# EasyEDA Pro project 小张FOC-STM32G431CBU6.epro, schematic Schematic1_4
Board Name: 主驱一体_V1.2（有源晶振）; Create Date: 2024-11-16; Page Name: P1; Project Name: 小张FOC-STM32G431CBU6; Schematic Name: Schematic1_4; Update Date: 2025-01-13; Company: 嘉立创EDA; Page Size: A3; Version: V1.0
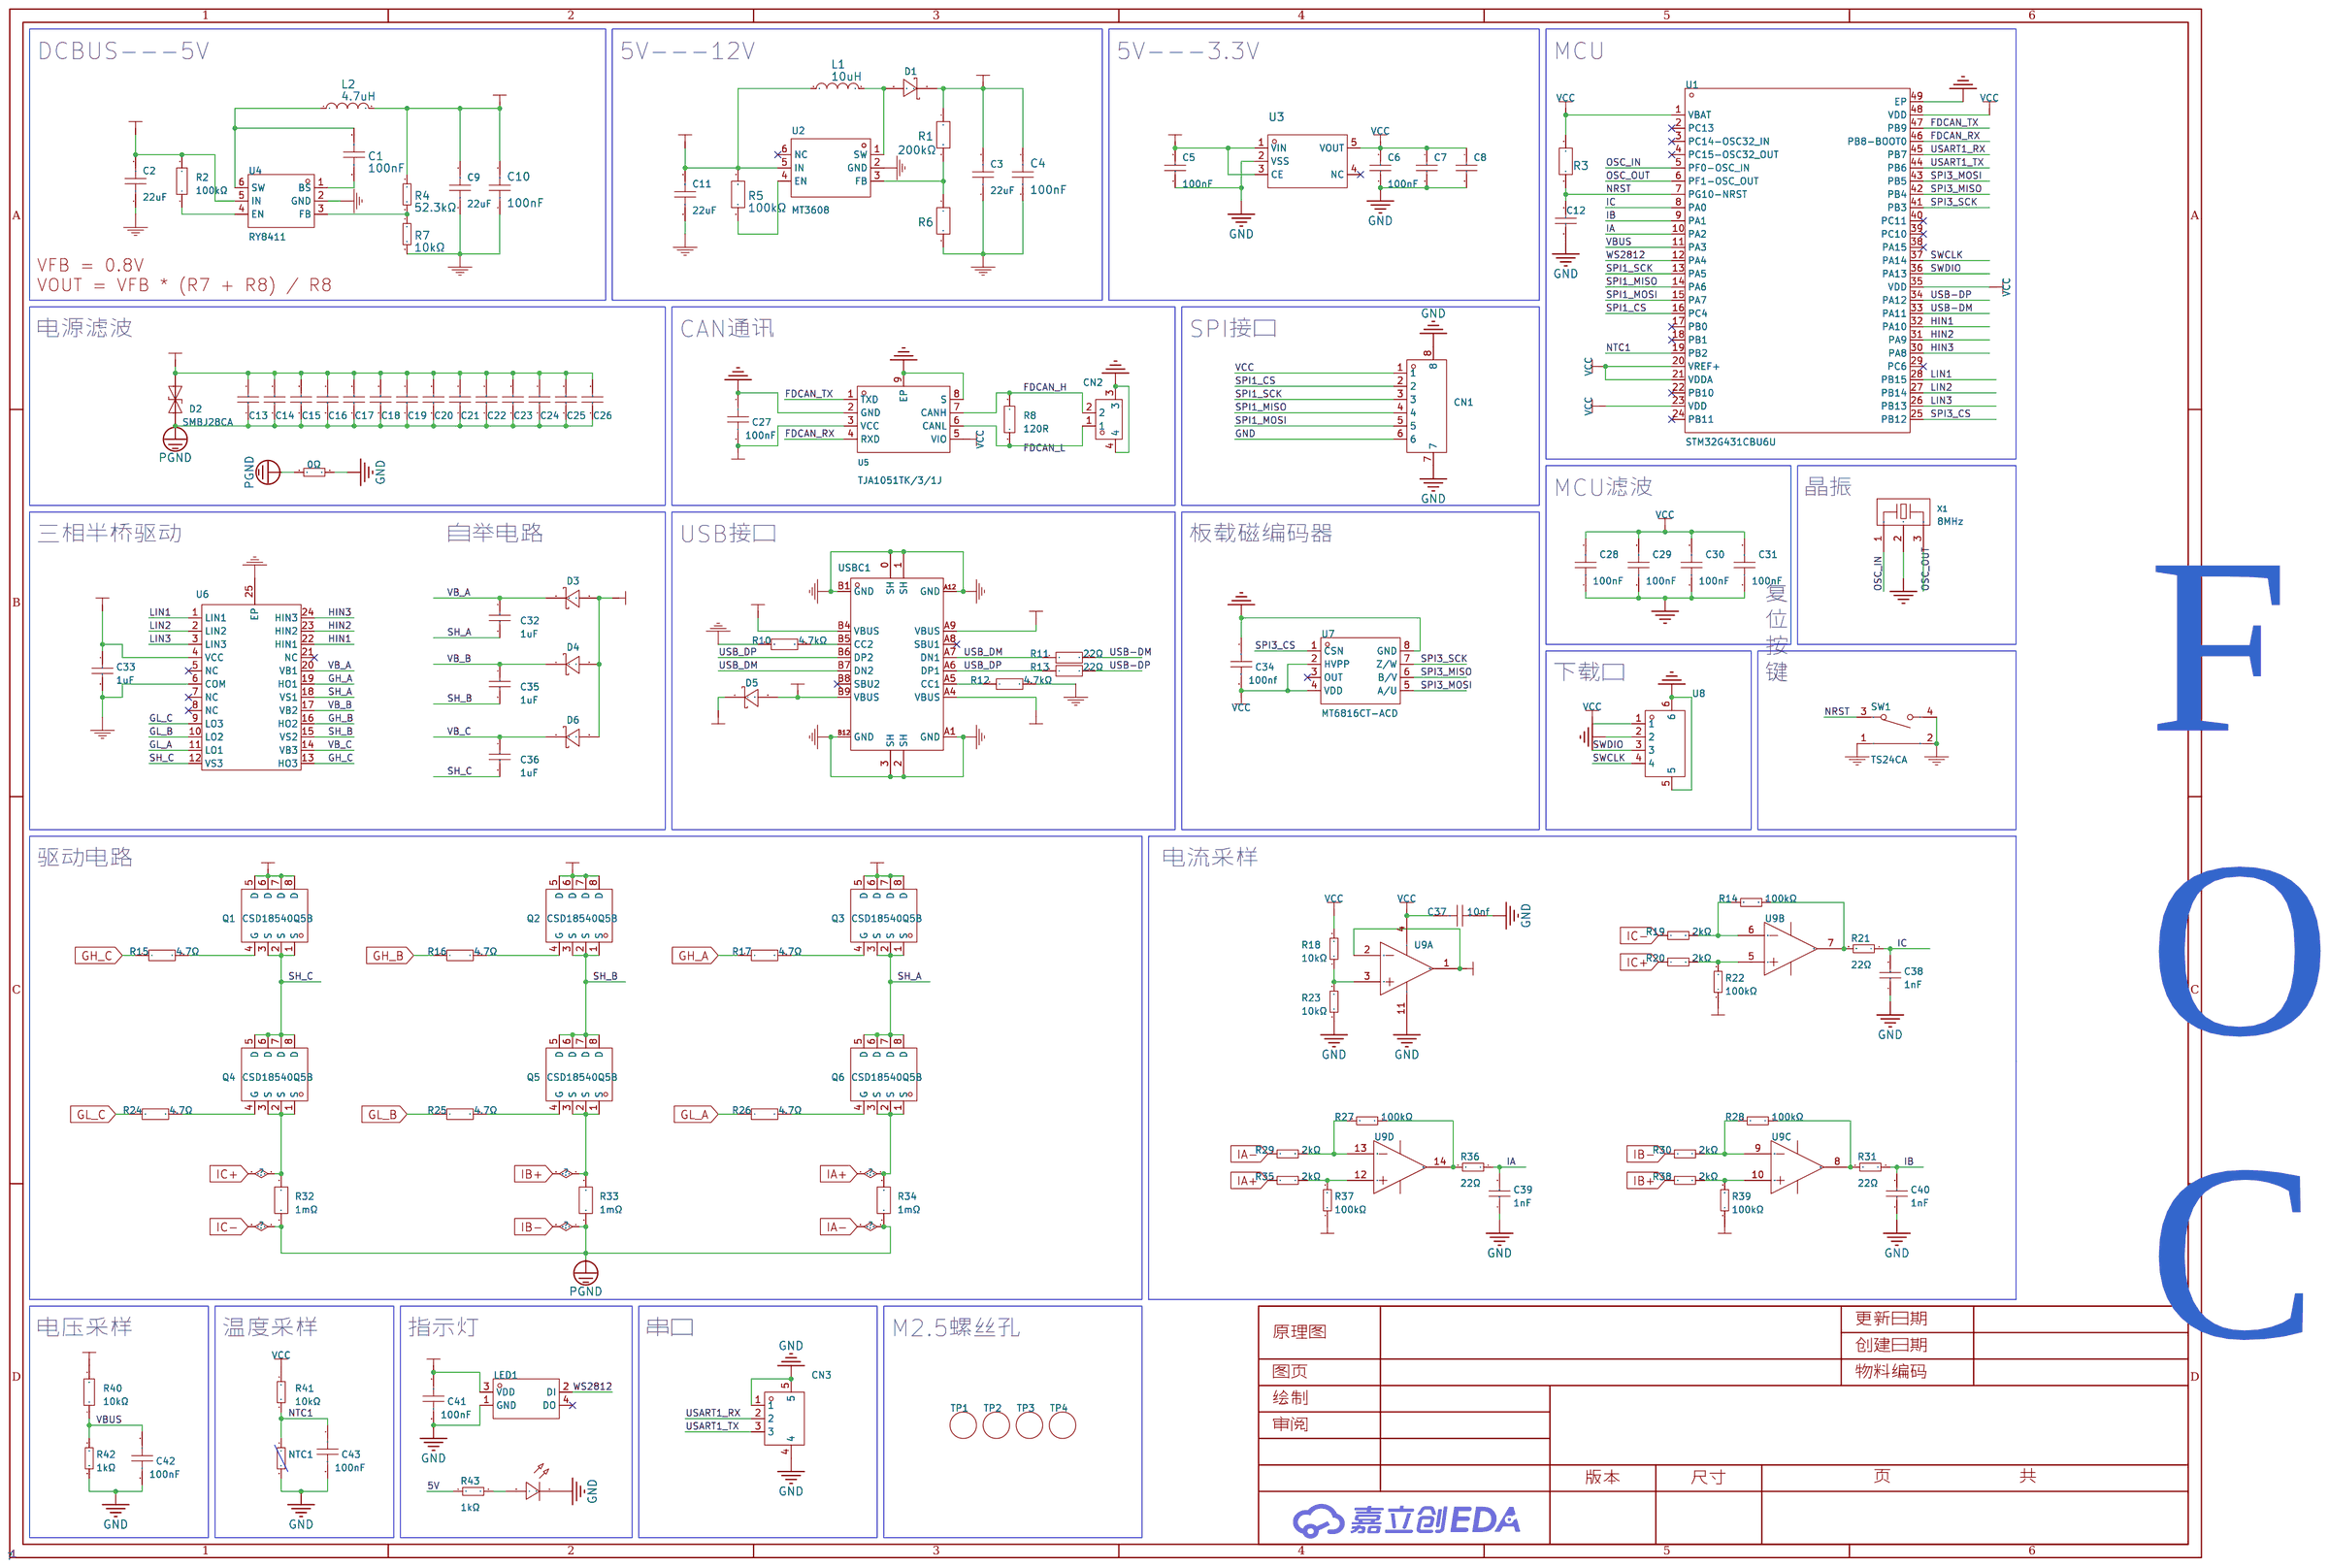
[diagram p6: schematic sheet]

## Parts
C1  100nF  [C0603_S]
C2  22uF  [C0805_SMALL]
C3  22uF  [C0805_SMALL]
C4  100nF  [C0603_SMALL]
C5  100nF  [C0603_SMALL]
C6  100nF  [C0603_SMALL]
C7  100nF  [C0603_SMALL]
C8  100nF  [C0603_SMALL]
C9  22uF  [C0805_SMALL]
C10  100nF  [C0603_S]
C11  22uF  [C0805_SMALL]
C12  100nF  [C0603_SMALL]
C13  10uF  [C1206_SMALL]
C14  10uF  [C1206_SMALL]
C15  10uF  [C1206_SMALL]
C16  10uF  [C1206_SMALL]
C17  10uF  [C1206_SMALL]
C18  10uF  [C1206_SMALL]
C19  10uF  [C1206_SMALL]
C20  10uF  [C1206_SMALL]
C21  10uF  [C1206_SMALL]
C22  10uF  [C1206_SMALL]
C23  10uF  [C1206_SMALL]
C24  10uF  [C1206_SMALL]
C25  10uF  [C1206_SMALL]
C26  10uF  [C1206_SMALL]
C27  100nF  [C0603_SMALL]
C28  100nF  [C0603_SMALL]
C29  100nF  [C0603_SMALL]
C30  100nF  [C0603_SMALL]
C31  100nF  [C0603_SMALL]
C32  1uF  [C0603_SMALL]
C33  1uF  [C0603_SMALL]
C34  100nf  [C0603_SMALL]
C35  1uF  [C0603_SMALL]
C36  1uF  [C0603_SMALL]
C37  10nf  [C0603_SMALL]
C38  1nF  [C0603_S]
C39  1nF  [C0603_S]
C40  1nF  [C0603_S]
C41  100nF  [C0603_SMALL]
C42  100nF  [C0603_SMALL]
C43  100nF  [C0603_SMALL]
CN1  WAFER-GH1.25-6PWB  [CONN-SMD_6P-P1.25_XUNPU_WAFER-GH1.25-6PWB]
CN2  X1251WRS-02HF-LPSW  [CONN-SMD_2P-P1.25_X1251WRS-02HF-LPSW]
CN3  WAFER-GH1.25-3PWB  [CONN-TH_3P-P1.25_GH1.25]
D1  B16WS  [SOD-323_L1.8-W1.3-LS2.5-RD]
D2  SMBJ28CA  [SMB_L4.6-W3.6-LS5.3-BI]
D3  B16WS  [SOD-323_L1.8-W1.3-LS2.5-RD]
D4  B16WS  [SOD-323_L1.8-W1.3-LS2.5-RD]
D5  B16WS  [SOD-323_L1.8-W1.3-LS2.5-RD]
D6  B16WS  [SOD-323_L1.8-W1.3-LS2.5-RD]
L1  10uH  [IND-SMD_L2.5-W2.0]
L2  4.7uH  [IND-SMD_L2.5-W2.0]
LED1  XL-3528RGBW-WS2812B  [LED-SMD_4P-L3.5-W2.8-BR-1]
LED2  -  [LED0603_RED_SMALL]
NTC1  NCP18XH103F03RB  [R0603_SMALL]
Q1  CSD18540Q5B  [VSON-CLIP-8_L5.0-W6.0-P1.27-BL]
Q2  CSD18540Q5B  [VSON-CLIP-8_L5.0-W6.0-P1.27-BL]
Q3  CSD18540Q5B  [VSON-CLIP-8_L5.0-W6.0-P1.27-BL]
Q4  CSD18540Q5B  [VSON-CLIP-8_L5.0-W6.0-P1.27-BL]
Q5  CSD18540Q5B  [VSON-CLIP-8_L5.0-W6.0-P1.27-BL]
Q6  CSD18540Q5B  [VSON-CLIP-8_L5.0-W6.0-P1.27-BL]
R1  200kΩ  [r0603_small]
R2  100kΩ  [R0603_SMALL]
R3  10kΩ  [R0603_SMALL]
R4  52.3kΩ  [R0603_S]
R5  100kΩ  [r0603_small]
R6  10kΩ  [r0603_small]
R7  10kΩ  [R0603_S]
R8  120R  [R0603_SMALL]
R9  0Ω  [R0603_SMALL]
R10  4.7kΩ  [R0603_SMALL]
R11  22Ω  [R0603_SMALL]
R12  4.7kΩ  [R0603_SMALL]
R13  22Ω  [R0603_SMALL]
R14  100kΩ  [R0603_S]
R15  4.7Ω  [R0603_SMALL]
R16  4.7Ω  [R0603_SMALL]
R17  4.7Ω  [R0603_SMALL]
R18  10kΩ  [R0603_S]
R19  2kΩ  [R0603_S]
R20  2kΩ  [R0603_S]
R21  22Ω  [R0603_S]
R22  100kΩ  [R0603_S]
R23  10kΩ  [R0603_S]
R24  4.7Ω  [R0603_SMALL]
R25  4.7Ω  [R0603_SMALL]
R26  4.7Ω  [R0603_SMALL]
R27  100kΩ  [R0603_S]
R28  100kΩ  [R0603_S]
R29  2kΩ  [R0603_S]
R30  2kΩ  [R0603_S]
R31  22Ω  [R0603_S]
R32  1mΩ  [RES-SMD_L6.4-W3.2_LR2512D-3W-1MR]
R33  1mΩ  [RES-SMD_L6.4-W3.2_LR2512D-3W-1MR]
R34  1mΩ  [RES-SMD_L6.4-W3.2_LR2512D-3W-1MR]
R35  2kΩ  [R0603_S]
R36  22Ω  [R0603_S]
R37  100kΩ  [R0603_S]
R38  2kΩ  [R0603_S]
R39  100kΩ  [R0603_S]
R40  10kΩ  [R0603_SMALL]
R41  10kΩ  [R0603_SMALL]
R42  1kΩ  [R0603_SMALL]
R43  1kΩ  [R0603_SMALL]
SW1  TS24CA  [SW-SMD_TS24CA]
TP1  -  [M2.5螺丝孔]
TP2  -  [M2.5螺丝孔]
TP3  -  [M2.5螺丝孔]
TP4  -  [M2.5螺丝孔]
U1  STM32G431CBU6U  [UFQFPN-48_L7.0-W7.0-P0.50-BL-EP5.6]
U2  MT3608  [SOT-23-6_L2.9-W1.6-P0.95-LS2.8-BR]
U3  XC6210B332MR  [SOT-23-5_L3.0-W1.7-P0.95-LS2.8-BR]
U4  RY8411  [SOT-23-6_L2.9-W1.6-P0.95-LS2.8-TL]
U5  TJA1051TK/3/1J  [HVSON-8_L3.0-W3.0-P0.65-BL-EP]
U6  FD6288Q  [QFN-24_L4.0-W4.0-P0.50-BL-EP2.6]
U7  MT6816CT-ACD  [SOP-8_L5.0-W4.0-P1.27-LS6.0-BL]
U8  WAFER-GH1.25-4PWB  [CONN-SMD_4P-P1.25_XUNPU_WAFER-GH1.25-4PWB]
U9  RS624XQ  [TSSOP-14_L5.0-W4.4-P0.65-LS6.4-BL]  (sections 1,2,3,4)
USBC1  TYPE-C-31-M-12  [USB-C_SMD-TYPE-C-31-M-12]
X1  8MHz  [OSC-SMD_3P-L3.2-W1.3-P1.2-L]

## Library data of the parts
C1 C10 = 0603B104K500NT: 容值:100nF;精度:±10%;额定电压:50V;材质(温度系数):X7R;; LCSC Part Name: 100nF ±10% 50V; Supplier Part: C30926; Manufacturer: FH(风华); Supplier Footprint: 0603; JLCPCB Part Class: Extended Part; Datasheet: https://atta.szlcsc.com/upload/public/pdf/source/20200305/C486355_26A10D38EF8C2A5C37091D0039909270.pdf; Supplier: LCSC; Tolerance: ±10%; Voltage Rated: 50V; Temperature Coefficient: X7R; Check: true
C2 C3 C9 C11 = CL21A226MAQNNNE: 容值:22uF;精度:±20%;额定电压:25V;材质(温度系数):X5R;; LCSC Part Name: 22uF ±20% 25V; Supplier Part: C45783; Manufacturer: SAMSUNG(三星); Supplier Footprint: 0805; JLCPCB Part Class: 基础库; Datasheet: https://atta.szlcsc.com/upload/public/pdf/source/20160218/1457707763339.pdf; Supplier: LCSC; Tolerance: ±20%; Voltage Rated: 25V; Temperature Coefficient: X5R
C4 = CC0603KRX7R9BB104: 容值:100nF;精度:±10%;额定电压:50V;材质(温度系数):X7R;; LCSC Part Name: 100nF ±10% 50V; Supplier Part: C14663; Manufacturer: YAGEO(国巨); Supplier Footprint: 0603; JLCPCB Part Class: 基础库; Datasheet: https://atta.szlcsc.com/upload/public/pdf/source/20180910/C282072_33301C7F631E79921B82A8DAC6BCC5B3.pdf; Supplier: LCSC; Tolerance: ±10%; Voltage Rated: 50V; Temperature Coefficient: X7R; Check: true
C5 C6 = CL10A106MA8NRNC: 容值:10uF;精度:±20%;额定电压:25V;材质(温度系数):X5R;; LCSC Part Name: 10uF ±20% 25V; Supplier Part: C96446; Manufacturer: SAMSUNG(三星); Supplier Footprint: 0603; JLCPCB Part Class: 基础库; Datasheet: https://atta.szlcsc.com/upload/public/pdf/source/20160218/1457707763339.pdf; Supplier: LCSC; Tolerance: ±20%; Voltage Rated: 25V; Temperature Coefficient: X5R; Pin Type: IN; Check: true
C7 C8 C12 = 0603B104K500NT: 容值:100nF;精度:±10%;额定电压:50V;材质(温度系数):X7R;; LCSC Part Name: 100nF ±10% 50V; Supplier Part: C30926; Manufacturer: FH(风华); Supplier Footprint: 0603; JLCPCB Part Class: Extended Part; Datasheet: https://atta.szlcsc.com/upload/public/pdf/source/20200305/C486355_26A10D38EF8C2A5C37091D0039909270.pdf; Supplier: LCSC; Tolerance: ±10%; Voltage Rated: 50V; Temperature Coefficient: X7R; Pin Type: IN; Check: true
C13-C26 = CL31A106KBHNNNE: 容值:10uF;精度:±10%;额定电压:50V;材质(温度系数):X5R;; LCSC Part Name: 10uF ±10% 50V; Supplier Part: C13585; Manufacturer: SAMSUNG(三星); Supplier Footprint: 1206; JLCPCB Part Class: Basic Part; Datasheet: https://atta.szlcsc.com/upload/public/pdf/source/20160218/1457707763339.pdf; Supplier: LCSC; Tolerance: ±10%; Voltage Rated: 50V; Temperature Coefficient: X5R; Pin Type: IN; 值: 10UF; Check: true
C27-C31 C34 C37 C41-C43 = 0603B104K500NT: 容值:100nF;精度:±10%;额定电压:50V;材质(温度系数):X7R;; LCSC Part Name: 100nF ±10% 50V; Supplier Part: C30926; Manufacturer: FH(风华); Supplier Footprint: 0603; JLCPCB Part Class: Extended Part; Datasheet: https://atta.szlcsc.com/upload/public/pdf/source/20200305/C486355_26A10D38EF8C2A5C37091D0039909270.pdf; Supplier: LCSC; Tolerance: ±10%; Voltage Rated: 50V; Temperature Coefficient: X7R
C32 C33 C35 C36 = C0603_S: Pin Type: IN; Supplier Part: C1604; Check: true
C38-C40 = 0603B102K500NT: 容值:1nF;精度:±10%;额定电压:50V;材质(温度系数):X7R;; LCSC Part Name: 1nF ±10% 50V; Supplier Part: C44369; Manufacturer: FH(风华); Supplier Footprint: 0603; JLCPCB Part Class: Extended Part; Datasheet: https://atta.szlcsc.com/upload/public/pdf/source/20200305/C486355_26A10D38EF8C2A5C37091D0039909270.pdf; Supplier: LCSC; Tolerance: ±10%; Voltage Rated: 50V; Temperature Coefficient: X7R; Pin Type: IN; Check: true
CN1 = WAFER-GH1.25-6PWB: 参考系列:GH;间距:1.25mm;插针结构:1x6P;排数:1;每排PIN数:6;公母:公型插针;安装方式:卧贴;额定电流:1A;工作温度范围:-25~+85;; LCSC Part Name: GH1.25mm6P卧贴带扣带扣; Supplier Part: C3029381; Manufacturer: XUNPU(讯普); Supplier Footprint: SMD,P=1.25mm; JLCPCB Part Class: ExtendedPart; Datasheet: https://atta.szlcsc.com/upload/public/pdf/source/20220527/CB8773BFB0913C3B8ABD62CB38BA101A.pdf; Supplier: LCSC; Reference Series: GH; Pitch: 1.25mm; Pins Structure: 1x6P; Number of Rows: 1; Number of PINs Per Row: 6; Gender: 公型插针; Mounting Style: 卧贴; Current Rating (Max): 1A; Operating Temperature Range: -25~+85; Check: true
CN2 = X1251WRS-02HF-LPSW: 插针结构:1x2P;间距:1.25mm;安装方式:卧贴;参考系列:GH;总PIN数:2P;排数:1;每排PIN数:2;行距:-;额定电流:1A;触头材质:黄铜;触头镀层:锡;工作温度范围:-;; LCSC Part Name: 1x2P 间距:1.25mm 卧贴 系列:GH; Supplier Part: C388707; Manufacturer: XKB Connection(中国星坤); Supplier Footprint: SMD,P=1.25mm,卧贴; JLCPCB Part Class: 扩展库; Datasheet: https://atta.szlcsc.com/upload/public/pdf/source/20211011/E2F7306AE87519079AD4EC816349A567.pdf; Supplier: LCSC; Pins Structure: 1x2P; Pitch: 1.25mm; Mounting Style: 卧贴; Reference Series: GH; Number of Pins: 2P; Number of Rows: 1; Number of PINs Per Row: 2; Current Rating (Max): 1A; Contact Material: 黄铜; Contact Plating: 锡
CN3 = WAFER-GH1.25-3PWB: 插针结构:1x3P;间距:1.25mm;安装方式:卧贴;参考系列:GH;总PIN数:3P;排数:1;每排PIN数:3;额定电流:1A;工作温度范围:-25℃~+85℃;; LCSC Part Name: 1x3P 间距:1.25mm 卧贴 系列:GH; Supplier Part: C3029378; Manufacturer: XUNPU(讯普); Supplier Footprint: SMD,P=1.25mm,卧贴; JLCPCB Part Class: 扩展库; Datasheet: https://atta.szlcsc.com/upload/public/pdf/source/20220527/CB8773BFB0913C3B8ABD62CB38BA101A.pdf; Supplier: LCSC; Pins Structure: 1x3P; Pitch: 1.25mm; Mounting Style: 卧贴; Reference Series: GH; Number of Pins: 3P; Number of Rows: 1; Number of PINs Per Row: 3; Current Rating (Max): 1A; Operating Temperature Range: -25℃~+85℃
D1 D3 D4 D6 = B16WS_C364278: 直流反向耐压(Vr):40V;平均整流电流(Io):1A;正向压降(Vf):650mV@1A;; Supplier Part: C364278; Manufacturer: MDD; Supplier Footprint: SOD-323; JLCPCB Part Class: Extended Part; Datasheet: https://atta.szlcsc.com/upload/public/pdf/source/20190125/C364278_08C9E980565605CB111C36D3361AA1D7.pdf; Supplier: LCSC; Reverse Voltage (Vr): 40V; Average Rectified Current (Io): 1A; Forward Voltage (Vf@If): 650mV@1A; Check: true
D2 = SMBJ28CA: 反向截止电压(Vrwm):28V;最大钳位电压:45.4V;峰值脉冲电流(Ipp)@10/1000us:13.2A;击穿电压:31.1V;; Supplier Part: C356756; Manufacturer: JJW(捷捷微); Supplier Footprint: SMB(DO-214AA); JLCPCB Part Class: 扩展库; Datasheet: https://atta.szlcsc.com/upload/public/pdf/source/20190118/C364661_581AFCFF6ECC065E7F89B606E0837F4E.pdf; Supplier: LCSC; Reverse Stand-Off Voltage (Vrwm): 28V; Maximum Clamping Voltage: 45.4V; Peak Pulse Current (Ipp)@10/1000us: 13.2A; Breakdown Voltage: 31.1V; Reverse Leakage Current (Ir): 1uA; Type: TVS
D5 = B16WS_C364278: 直流反向耐压(Vr):60V;平均整流电流(Io):1A;正向压降(Vf):700mV@1A;; Supplier Part: C364278; Manufacturer: MDD; Supplier Footprint: SOD-323; JLCPCB Part Class: Extended Part; Datasheet: https://atta.szlcsc.com/upload/public/pdf/source/20190125/C364278_08C9E980565605CB111C36D3361AA1D7.pdf; Supplier: LCSC; Reverse Voltage (Vr): 60V; Average Rectified Current (Io): 1A; Forward Voltage (Vf@If): 700mV@1A; Check: true
L1 = SWPA252012S4R7MT: 电感值:4.7uH;精度:±20%;额定电流:840mA;直流电阻(DCR):377mΩ;; LCSC Part Name: 4.7uH ±20% 840mA 377mΩ; Supplier Part: C87640; Manufacturer: Sunlord(顺络); Supplier Footprint: SMD; JLCPCB Part Class: Extended Part; Datasheet: https://atta.szlcsc.com/upload/public/pdf/source/20210916/AC798BA7E846B7D0B6818F45CD84DB0B.pdf; Supplier: LCSC; Tolerance: ±20%; Rated Current: 840mA; DC Resistance (DCR): 377mΩ
L2 = MPIH252010-4R7M-LF: 电感值:4.7uH;精度:±20%;额定电流:1A;; LCSC Part Name: 4.7uH ±20% 1A 275mΩ; Supplier Part: C490449; Manufacturer: microgate(麦捷科技); Supplier Footprint: SMD; JLCPCB Part Class: Extended Part; Datasheet: https://atta.szlcsc.com/upload/public/pdf/source/20200707/C490443_2060EC88E48E101AE91DC68C352BCAF4.pdf; Supplier: LCSC; Tolerance: ±20%; Rated Current: 1A; DC Resistance (DCR): 275mΩ; Check: true
LED1 = XL-3528RGBW-WS2812B: 发光颜色:RGB三色;二极管配置:-;主波长:618nm~623nm；520nm~525nm；467nm~472nm;功率:50mW；50mW；45mW;安装方式:正贴;; LCSC Part Name: RGB三色 正贴 幻彩; Supplier Part: C2890364; Manufacturer: XINGLIGHT(成兴光); Supplier Footprint: SMD3528-4P; JLCPCB Part Class: 扩展库; Datasheet: https://atta.szlcsc.com/upload/public/pdf/source/20221102/50F456983F591359B0D81AA557777463.pdf; Supplier: LCSC; Emitted Color: RGB三色; Dominant Wavelength: 618nm~623nm；520nm~525nm；467nm~472nm; Peak Wavelength: 525nm；623nm；472nm; Forward Current: 20mA; Power Dissipation: 50mW；50mW；45mW; Viewing Angle: 120°; Mounting Sytle: 正贴; Operating Temperature: -25℃~+80℃; Check: true
LED2 = LED_0603-R: Supplier Footprint: 0603
NTC1 = NCP18XH103F03RB: 阻值(25℃):10kΩ;电阻精度:±1%;B值精度:±1%;B值(25℃/50℃):3380K;功率:100mW;最大稳态电流(25℃):310uA;B值(25℃/75℃):-;B值(25℃/85℃):3334K;B值(25℃/100℃):3455K;工作温度:-40℃~+125℃;; LCSC Part Name: 10kΩ 电阻精度:±1% 3380K; Supplier Part: C13564; Manufacturer: muRata(村田); Supplier Footprint: 0603; JLCPCB Part Class: Extended Part; Supplier: LCSC; Resistance @ 25℃: 10kΩ; Resistance Tolerance: ±1%; B Constant Tolerance: ±1%; B Constant (25℃/50℃): 3380K; Power: 100mW; Steady State Current (Max): 310uA; B Constant (25℃/85℃): 3334K; B Constant (25℃/100℃): 3455K; Operating Temperature: -40℃~+125℃; Pin Type: IN; Check: true
Q1-Q6 = CSD18540Q5B: 类型:1个N沟道;漏源电压(Vdss):60V;连续漏极电流(Id):100A;功率(Pd):3.1W；195W;导通电阻(RDS(on)@Vgs,Id):2.2mΩ@10V,28A;阈值电压(Vgs(th)@Id):2.3V@250uA;; LCSC Part Name: 1个N沟道 耐压:60V 电流:100A; Supplier Part: C86513; Manufacturer: TI(德州仪器); Supplier Footprint: VSON-8(5x6); JLCPCB Part Class: 扩展库; Datasheet: https://www.ti.com/cn/lit/gpn/csd18540q5b; Supplier: LCSC; Type: 1个N沟道; Drain Source Voltage (Vdss): 60V; Continuous Drain Current (Id): 100A; Power Dissipation (Pd): 3.1W；195W; Drain Source On Resistance (RDS(on)@Vgs,Id): 2.2mΩ@10V,28A; Gate Threshold Voltage (Vgs(th)@Id): 2.3V@250uA; Total Gate Charge (Qg@Vgs): 53nC@10V; Input Capacitance (Ciss@Vds): 4.23nF@30V; Operating Temperature: -55℃~+150℃@(Tj)
R1 = RMC 0603 52K3 F N: 阻值:52.3kΩ;精度:±1%;功率:100mW;; LCSC Part Name: 52.3kΩ ±1% 100mW; Supplier Part: C325624; Manufacturer: Tyohm(幸亚电阻); Supplier Footprint: 0603; JLCPCB Part Class: Extended Part; Datasheet: https://atta.szlcsc.com/upload/public/pdf/source/20190115/C325624_C83DA14843559B976A7F252575C1556F.pdf; Supplier: LCSC; Tolerance: ±1%; Power(Watts): 100mW; Check: true
R2 = 0603WAF1003T5E: 电阻类型:厚膜电阻;阻值:100kΩ;精度:±1%;功率:100mW;最大工作电压:75V;温度系数:±100ppm/℃;; LCSC Part Name: 100kΩ ±1% 100mW 厚膜电阻; Supplier Part: C25803; Manufacturer: UNI-ROYAL(厚声); Supplier Footprint: 0603; JLCPCB Part Class: 基础库; Datasheet: https://atta.szlcsc.com/upload/public/pdf/source/20200306/C422600_1E6D84923E4A46A82E41ADD87F860B5C.pdf; Supplier: LCSC; Type: 厚膜电阻; Tolerance: ±1%; Power(Watts): 100mW; Overload Voltage (Max): 75V; Temperature Coefficient: ±100ppm/℃; Operating Temperature Range: -55℃~+155℃
R3 R5 R6 = CR0603JA0103G: 电阻类型:厚膜电阻;阻值:10kΩ;精度:±5%;功率:100mW;温度系数:±200ppm/℃;最大工作电压:50V;工作温度范围:-55℃~+125℃;; LCSC Part Name: 10kΩ ±5% 100mW; Supplier Part: C101254; Manufacturer: LIZ(丽智电子); Supplier Footprint: 0603; JLCPCB Part Class: Extended Part; Datasheet: https://atta.szlcsc.com/upload/public/pdf/source/20170408/1491631441449.pdf; Supplier: LCSC; Type: 厚膜电阻; Tolerance: ±5%; Power(Watts): 100mW; Temperature Coefficient: ±200ppm/℃; Overload Voltage (Max): 50V; Operating Temperature Range: -55℃~+125℃; Check: true
R4 = 0603WAF6202T5E: 阻值:62kΩ;精度:±1%;功率:100mW;温度系数:±100ppm/℃;电阻类型:厚膜电阻;; LCSC Part Name: 62kΩ ±1% 100mW 厚膜电阻; Supplier Part: C23221; Manufacturer: UNI-ROYAL(厚声); Supplier Footprint: 0603; JLCPCB Part Class: Basic Part; Datasheet: https://atta.szlcsc.com/upload/public/pdf/source/20200306/C422600_1E6D84923E4A46A82E41ADD87F860B5C.pdf; Supplier: LCSC; Tolerance: ±1%; Power(Watts): 100mW; Overload Voltage (Max): 75V; Temperature Coefficient: ±100ppm/℃; Type: 厚膜电阻; Operating Temperature Range: -55℃~+155℃; Pin Type: IN; 美岩编码: A00010; 单价: 0.009222; Check: true
R7 = 0603WAF1202T5E: 阻值:12kΩ;精度:±1%;功率:100mW;温度系数:±100ppm/℃;电阻类型:厚膜电阻;; LCSC Part Name: 12kΩ ±1% 100mW 厚膜电阻; Supplier Part: C22790; Manufacturer: UNI-ROYAL(厚声); Supplier Footprint: 0603; JLCPCB Part Class: Basic Part; Datasheet: https://atta.szlcsc.com/upload/public/pdf/source/20200306/C422600_1E6D84923E4A46A82E41ADD87F860B5C.pdf; Supplier: LCSC; Tolerance: ±1%; Power(Watts): 100mW; Overload Voltage (Max): 75V; Temperature Coefficient: ±100ppm/℃; Type: 厚膜电阻; Operating Temperature Range: -55℃~+155℃; Pin Type: IN; 美岩编码: A00010; 单价: 0.009222; Check: true
R8 = Res_0603: Supplier Footprint: 0603
R9 = RS-03000FT: 阻值:0Ω;精度:±1%;功率:100mW;; LCSC Part Name: 0Ω ±1% 100mW; Supplier Part: C136582; Manufacturer: FH(风华); Supplier Footprint: 0603; JLCPCB Part Class: Extended Part; Datasheet: https://atta.szlcsc.com/upload/public/pdf/source/20171106/C136582_15099532019501092527.pdf; Supplier: LCSC; Tolerance: ±1%; Power(Watts): 100mW; Overload Voltage (Max): 50V; Operating Temperature Range: -55℃~+155℃; Pin Type: IN; Check: true
R10 R12 = 0603WAF4701T5E: 电阻类型:厚膜电阻;阻值:4.7kΩ;精度:±1%;功率:100mW;最大工作电压:75V;温度系数:±100ppm/℃;; LCSC Part Name: 4.7kΩ ±1% 100mW 厚膜电阻; Supplier Part: C23162; Manufacturer: UNI-ROYAL(厚声); Supplier Footprint: 0603; JLCPCB Part Class: 基础库; Datasheet: https://atta.szlcsc.com/upload/public/pdf/source/20200306/C422600_1E6D84923E4A46A82E41ADD87F860B5C.pdf; Supplier: LCSC; Type: 厚膜电阻; Tolerance: ±1%; Power(Watts): 100mW; Overload Voltage (Max): 75V; Temperature Coefficient: ±100ppm/℃; Operating Temperature Range: -55℃~+155℃
R11 R13 = 0603WAF220JT5E: 电阻类型:厚膜电阻;阻值:22Ω;精度:±1%;功率:100mW;最大工作电压:75V;温度系数:±100ppm/℃;; LCSC Part Name: 22Ω ±1% 100mW 厚膜电阻; Supplier Part: C23345; Manufacturer: UNI-ROYAL(厚声); Supplier Footprint: 0603; JLCPCB Part Class: 基础库; Datasheet: https://atta.szlcsc.com/upload/public/pdf/source/20200306/C422600_1E6D84923E4A46A82E41ADD87F860B5C.pdf; Supplier: LCSC; Type: 厚膜电阻; Tolerance: ±1%; Power(Watts): 100mW; Overload Voltage (Max): 75V; Temperature Coefficient: ±100ppm/℃; Operating Temperature Range: -55℃~+155℃
R14 R18 R22 R23 R27 R28 R37 R39 = RT0603BRD0720KL: 电阻类型:薄膜电阻;阻值:20kΩ;精度:±0.1%;功率:100mW;; LCSC Part Name: 20kΩ ±0.1% 100mW; Supplier Part: C723637; Manufacturer: YAGEO(国巨); Supplier Footprint: 0603; JLCPCB Part Class: Extended Part; Datasheet: https://atta.szlcsc.com/upload/public/pdf/source/20200814/C723637_57E5E8B3C02F5D5BA42E401EB3E82C8B.pdf; Supplier: LCSC; Type: 薄膜电阻; Tolerance: ±0.1%; Power(Watts): 100mW; Temperature Coefficient: ±25ppm/℃; Overload Voltage (Max): 75V; Operating Temperature Range: -55℃~+155℃; Pin Type: IN; Check: true
R15-R17 R21 R24-R26 R31 R36 = 0603WAF220JT5E: 电阻类型:厚膜电阻;阻值:22Ω;精度:±1%;功率:100mW;最大工作电压:75V;温度系数:±100ppm/℃;; LCSC Part Name: 22Ω ±1% 100mW 厚膜电阻; Supplier Part: C23345; Manufacturer: UNI-ROYAL(厚声); Supplier Footprint: 0603; JLCPCB Part Class: 基础库; Datasheet: https://atta.szlcsc.com/upload/public/pdf/source/20200306/C422600_1E6D84923E4A46A82E41ADD87F860B5C.pdf; Supplier: LCSC; Type: 厚膜电阻; Tolerance: ±1%; Power(Watts): 100mW; Overload Voltage (Max): 75V; Temperature Coefficient: ±100ppm/℃; Operating Temperature Range: -55℃~+155℃; Pin Type: IN; Check: true
R19 R20 R29 R30 R35 R38 = RT0603BRD071KL: 电阻类型:薄膜电阻;阻值:1kΩ;精度:±0.1%;功率:100mW;; LCSC Part Name: 1kΩ ±0.1% 100mW; Supplier Part: C110776; Manufacturer: YAGEO(国巨); Supplier Footprint: 0603; JLCPCB Part Class: Extended Part; Datasheet: https://atta.szlcsc.com/upload/public/pdf/source/20170704/1499151282044.pdf; Supplier: LCSC; Type: 薄膜电阻; Tolerance: ±0.1%; Power(Watts): 100mW; Temperature Coefficient: ±25ppm/℃; Overload Voltage (Max): 75V; Operating Temperature Range: -55℃~+155℃; Pin Type: IN; Check: true
R32-R34 = LR2512D-3W-1mR-1%: 电阻类型:采样电阻;阻值:1mΩ;精度:±1%;功率:3W;温度系数:25ppm/℃~+50ppm/℃;安装方式:贴片;; LCSC Part Name: 1mΩ ±1% 3W; Supplier Part: C500734; Manufacturer: Milliohm(毫欧); Supplier Footprint: 2512; JLCPCB Part Class: 扩展库; Datasheet: https://atta.szlcsc.com/upload/public/pdf/source/20211008/27BCB003066C6550DC06C87D8395239C.pdf; Supplier: LCSC; Type: 采样电阻; Tolerance: ±1%; Power(Watts): 3W; Temperature Coefficient: 25ppm/℃~+50ppm/℃; Mounting Sytle: 贴片
R40 = RC0603FR-0711KL: 电阻类型:厚膜电阻;阻值:11kΩ;精度:±1%;功率:100mW;最大工作电压:75V;温度系数:±100ppm/℃;; LCSC Part Name: 厚膜电阻 11kΩ ±1% 100mW; Supplier Part: C137801; Manufacturer: YAGEO(国巨); Supplier Footprint: 0603; JLCPCB Part Class: 扩展库; Datasheet: https://atta.szlcsc.com/upload/public/pdf/source/20180821/C275644_0D56F95EFF785E7D9A1FEF436B37DA78.pdf; Supplier: LCSC; Type: 厚膜电阻; Tolerance: ±1%; Power(Watts): 100mW; Overload Voltage (Max): 75V; Temperature Coefficient: ±100ppm/℃; Operating Temperature Range: -55℃~+155℃
R41 R43 = 0603WAF1002T5E: 阻值:10kΩ;精度:±1%;功率:100mW;温度系数:±100ppm/℃;电阻类型:厚膜电阻;; LCSC Part Name: 10kΩ ±1% 100mW 厚膜电阻; Supplier Part: C25804; Manufacturer: UNI-ROYAL(厚声); Supplier Footprint: 0603; JLCPCB Part Class: Basic Part; Datasheet: https://atta.szlcsc.com/upload/public/pdf/source/20200306/C422600_1E6D84923E4A46A82E41ADD87F860B5C.pdf; Supplier: LCSC; Tolerance: ±1%; Power(Watts): 100mW; Overload Voltage (Max): 75V; Temperature Coefficient: ±100ppm/℃; Type: 厚膜电阻; Operating Temperature Range: -55℃~+155℃; Pin Type: IN; Check: true
R42 = RC0603FR-071KL: 电阻类型:厚膜电阻;阻值:1kΩ;精度:±1%;功率:100mW;; LCSC Part Name: 1kΩ ±1% 100mW; Supplier Part: C22548; Manufacturer: YAGEO(国巨); Supplier Footprint: 0603; JLCPCB Part Class: Extended Part; Datasheet: https://atta.szlcsc.com/upload/public/pdf/source/20180312/7BD3618A8B6324EA6280B0497A051AB7.pdf; Supplier: LCSC; Type: 厚膜电阻; Tolerance: ±1%; Power(Watts): 100mW; Temperature Coefficient: ±100ppm/℃; Overload Voltage (Max): 75V; Operating Temperature Range: -55℃~+155℃; Pin Type: IN; Check: true
SW1 = TS24CA: 触点电流:50mA;额定电压(DC):12V;电路结构:单刀单掷;安装方式:卧贴;带灯:-;机械寿命:-;; LCSC Part Name: 4.55*1.8*3.5mm 卧贴 轻触开关; Supplier Part: C393942; Manufacturer: SHOU HAN(首韩); Supplier Footprint: SMD; JLCPCB Part Class: Extended Part; Datasheet: https://atta.szlcsc.com/upload/public/pdf/source/20190521/C393942_591A9E318887EFA4274D34029981AD99.pdf; Supplier: LCSC; Contact Current: 50mA; Voltage Rating (DC): 12V; Circuit: 单刀单掷; Mounting Style: 卧贴; Actuator Style: 矩形按钮; Switch Length: 4.55mm; Switch Width: 1.8mm; Switch Height: 3.5mm
TP1-TP4 = M2.5螺丝孔: _: 3
U1 = STM32G431CBU6U: CPU内核:CM4;程序存储容量:128KB;RAM总容量:32KB;GPIO端口数量:42;工作电压范围:1.71V~3.6V;CPU最大主频:170MHz;程序存储器类型:FLASH;; Supplier Part: C1341712; Manufacturer: ST(意法半导体); Supplier Footprint: UFQFPN-48(7x7); JLCPCB Part Class: 扩展库; Datasheet: https://atta.szlcsc.com/upload/public/pdf/source/20210607/F3CD0646E5D00AAFDE875C196C2D7333.pdf; Supplier: LCSC; CPU Core: CM4; Program Storage Size: 128KB; RAM Size: 32KB; GPIO Ports Number: 42; Operating Voltage Range: 1.71V~3.6V; CPU Maximum Speed: 170MHz; Program Memory Type: FLASH; Operating Temperature Range: -40℃~+85℃; ADC (Bit): 12bit; DAC (Bit): 12bit; Peripheral/Function: PWM；PWM; Internal Oscillator: 有
U2 = MT3608: 功能类型:升压型;同步整流:-;输出通道数:1;拓扑结构:升压式;输入电压:2V~24V;输出电压:28V;输出电流(最大值):-;开关频率:1.2MHz;; LCSC Part Name: 升压型 2V~24V 1.2MHz; Supplier Part: C84817; Manufacturer: 西安航天民芯; Supplier Footprint: SOT-23-6; JLCPCB Part Class: 扩展库; Datasheet: https://atta.szlcsc.com/upload/public/pdf/source/20161110/1478743351706.pdf; Supplier: LCSC; Function: 升压型; Number of Outputs: 1; Topology: 升压式; Input Voltage: 2V~24V; Output Voltage: 28V; Switching Frequency: 1.2MHz
U3 = XC6210B332MR_C424705: 输出类型:固定;输出极性:正;最大输入电压:6V;输出电压:3.3V;输出电流:900mA;电源纹波抑制比(PSRR):60dB@(1kHz);; Supplier Part: C424705; Manufacturer: TOREX(特瑞仕); Supplier Footprint: SOT-25; JLCPCB Part Class: Extended Part; Datasheet: https://atta.szlcsc.com/upload/public/pdf/source/20190903/C424705_1DFB2113A9A78D399905DBF688657204.pdf; Supplier: LCSC; Output Type: 固定; Output Polarity: 正; Number of Outputs: 1; Maximum Input Voltage: 6V; Output Voltage: 3.3V; Dropout Voltage: 75mV@(100mA); Output Current: 900mA; Power Supply Rejection Ratio (PSRR): 60dB@(1kHz); Power Supply Rejection Ratio (PRSS): 90dB@(100Hz),60dB@(100kHz); Check: true
U4 = RY8411_C2935411: Supplier Part: C2935411; Manufacturer: RYCHiP(蕊源); Supplier Footprint: SOT-23-6; JLCPCB Part Class: Extended Part; Datasheet: https://atta.szlcsc.com/upload/public/pdf/source/20211220/DB2E518D79CF9F576C855DA4549CDE87.pdf; Supplier: LCSC
U5 = TJA1051TK/3/1J: Supplier Part: C2875699; Manufacturer: NXP(恩智浦); Supplier Footprint: HVSON-8-EP(3x3); JLCPCB Part Class: 扩展库; Datasheet: https://atta.szlcsc.com/upload/public/pdf/source/20210128/C2671135_A82E49CDEFC20634F2534E8F261E286A.pdf; Supplier: LCSC
U6 = FD6288Q: Supplier Part: C328453; Manufacturer: Fortior Tech(峰岹); Supplier Footprint: QFN-24-EP(4x4); JLCPCB Part Class: 扩展库; Datasheet: https://atta.szlcsc.com/upload/public/pdf/source/20181108/C328453_785547738DB9FC0123219FC22539EFAD.pdf; Supplier: LCSC; Check: true
U7 = MT6816CT-ACD: AB=1024线，Z=4LSB，PWM=1KHz; LCSC Part Name: 零延迟磁角位置传感器IC; Supplier Part: C879560; Manufacturer: MagnTek(麦歌恩); Supplier Footprint: SOP-8; JLCPCB Part Class: 扩展库; Datasheet: https://atta.szlcsc.com/upload/public/pdf/source/20201027/C879560_21F27A21E71569DDEA564795613A647F.pdf; Supplier: LCSC
U8 = WAFER-GH1.25-4PWB: 插针结构:1x4P;间距:1.25mm;安装方式:卧贴;参考系列:GH;总PIN数:4P;排数:1;每排PIN数:4;额定电流:1A;工作温度范围:-25℃~+85℃;; LCSC Part Name: 1x4P 间距:1.25mm 卧贴 系列:GH; Supplier Part: C3029379; Manufacturer: XUNPU(讯普); Supplier Footprint: SMD,P=1.25mm,卧贴; JLCPCB Part Class: 扩展库; Datasheet: https://atta.szlcsc.com/upload/public/pdf/source/20220527/CB8773BFB0913C3B8ABD62CB38BA101A.pdf; Supplier: LCSC; Pins Structure: 1x4P; Pitch: 1.25mm; Mounting Style: 卧贴; Reference Series: GH; Number of Pins: 4P; Number of Rows: 1; Number of PINs Per Row: 4; Current Rating (Max): 1A; Operating Temperature Range: -25℃~+85℃
U9 = RS624XQ: 放大器数:四路;增益带宽积(GBP):7MHz;输入偏置电流(Ib):1pA;压摆率(SR):3.7V/us;带宽(-3db):-;轨到轨:-;; LCSC Part Name: 低噪声运放RS624XQ; Supplier Part: C237013; Manufacturer: RUNIC(润石); Supplier Footprint: TSSOP-14; JLCPCB Part Class: 扩展库; Datasheet: https://atta.szlcsc.com/upload/public/pdf/source/20180629/C237016_AF7FD780DD44CC08B5D0D5C046C0F0AE.pdf; Supplier: LCSC; Number of Circuits: 4; Gain Bandwidth Product(GBP): 1.1MHz; Current - Input Bias(Ib): 1pA; Slew Rate(SR): 0.5V/us; Output Current: 55mA; Rail to Rail: 轨到轨; Operating Temperature: -40℃~+125℃; Check: true
USBC1 = TYPE-C-31-M-12: 连接器类型:Type-C;标准:-;公母:母;端口数量:1;触点数量:16P;安装方式:-;额定电流 - 电源:5A;触头材质:-;触头镀层:-;工作温度范围:-;焊接温度(最大值):-;; LCSC Part Name: Type-C 母; Supplier Part: C165948; Manufacturer: 韩国韩荣; Supplier Footprint: SMD; JLCPCB Part Class: 扩展库; Datasheet: https://atta.szlcsc.com/upload/public/pdf/source/20220525/466408E853115E789EDB0DDC29077C05.pdf; Supplier: LCSC; Connector Type: Type-C; Gender: 母; Number of Ports: 1; Number of Contacts: 16P; Current Rating - Power (Max): 5A
X1 = CSTCE8M00G52-R0: 频率:8MHz;内置负载电容:10pF;谐振阻抗:40Ω;; LCSC Part Name: 8MHz ±0.5% 内置负载电容:10pF; Supplier Part: C22549; Manufacturer: muRata(村田); Supplier Footprint: SMD3213-3P; JLCPCB Part Class: 扩展库; Datasheet: https://atta.szlcsc.com/upload/public/pdf/source/20160120/1457707754326.pdf; Supplier: LCSC; Built-in Load Capacitance: 10pF; Resonant Impedance: 40Ω; Operating Temperature: -20℃~+80℃

## Nets
5V: C5.2 C9.2 C10.2 C11.2 C27.2 C41.1 D5.1 L1.1 L2.2 LED1.3(VDD) R4.1 R5.1 R43.1 U2.5(IN) U3.1(VIN) U3.3(CE) U5.3(VCC)
GND: C2.1 C3.1 C4.2 C5.1 C6.1 C7.2 C8.2 C9.1 C10.1 C11.1 C12.2 C27.1 C28.1 C29.1 C30.1 C31.1 C33.2 C34.1 C37.2 C38.1 C39.1 C40.1 C41.2 C42.2 C43.2 CN1.6 CN1.7 CN1.8 CN2.3 CN2.4 CN3.1 CN3.4 CN3.5 LED1.1(GND) LED2.1(C) NTC1.2 R6.2 R7.2 R9.2 R10.1 R12.2 R23.1 R42.2 SW1.1 SW1.2 SW1.4 U1.49(EP) U2.2(GND) U3.2(VSS) U4.2(GND) U5.2(GND) U5.8(S) U5.9(EP) U6.6(COM) U6.25(EP) U7.8(GND) U8.2 U8.5 U8.6 U9.11(V-) USBC1.0(SH) USBC1.1(SH) USBC1.2(SH) USBC1.3(SH) USBC1.A1(GND) USBC1.A12(GND) USBC1.B1(GND) USBC1.B12(GND) X1.2
PGND: C13.2 C14.2 C15.2 C16.2 C17.2 C18.2 C19.2 C20.2 C21.2 C22.2 C23.2 C24.2 C25.2 C26.2 D2.2(A) R9.1 R19.1 R29.1 R30.1 R32.1 R33.1 R34.1
VBUS: C42.1 R40.1 R42.1 U1.11(PA3)
VCC: C6.2 C7.1 C8.1 C28.2 C29.2 C30.2 C31.2 C34.2 C37.1 CN1.1 R3.1 R18.2 R41.1 U1.1(VBAT) U1.20(VREF+) U1.21(VDDA) U1.23(VDD) U1.35(VDD) U1.48(VDD) U3.5(VOUT) U5.5(VIO) U7.2(HVPP) U7.4(VDD) U8.1 U9.4(V+)
DCBUS: C2.2 C13.1 C14.1 C15.1 C16.1 C17.1 C18.1 C19.1 C20.1 C21.1 C22.1 C23.1 C24.1 C25.1 C26.1 D2.1(K) Q1.5(D) Q1.6(D) Q1.7(D) Q1.8(D) Q2.5(D) Q2.6(D) Q2.7(D) Q2.8(D) Q3.5(D) Q3.6(D) Q3.7(D) Q3.8(D) R2.2 R40.2 U4.5(IN)
FDCAN_H: CN2.2 R8.2 U5.7(CANH)
FDCAN_L: CN2.1 R8.1 U5.6(CANL)
FDCAN_RX: U1.46(PB8-BOOT0) U5.4(RXD)
FDCAN_TX: U1.47(PB9) U5.1(TXD)
GH_A: R17.1 U6.19(HO1)
GH_B: R16.1 U6.16(HO2)
GH_C: R15.1 U6.13(HO3)
GL_A: R26.1 U6.11(LO1)
GL_B: R25.1 U6.10(LO2)
GL_C: R24.1 U6.9(LO3)
HIN1: U1.32(PA10) U6.22(HIN1)
HIN2: U1.31(PA9) U6.23(HIN2)
HIN3: U1.30(PA8) U6.24(HIN3)
IA: C39.2 R36.1 U1.10(PA2)
IA+: Q6.1(S) Q6.2(S) Q6.3(S) R34.2 R35.1
IB: C40.2 R31.1 U1.9(PA1)
IB+: Q5.1(S) Q5.2(S) Q5.3(S) R33.2 R38.1
IC: C38.2 R21.1 U1.8(PA0)
IC+: Q4.1(S) Q4.2(S) Q4.3(S) R20.1 R32.2
LIN1: U1.28(PB15) U6.1(LIN1)
LIN2: U1.27(PB14) U6.2(LIN2)
LIN3: U1.26(PB13) U6.3(LIN3)
NRST: C12.1 R3.2 SW1.3 U1.7(PG10-NRST)
NTC1: C43.1 NTC1.1 R41.2 U1.19(PB2)
OSC_IN: U1.5(PF0-OSC_IN) X1.1
OSC_OUT: U1.6(PF1-OSC_OUT) X1.3
SH_A: C32.2 Q3.1(S) Q3.2(S) Q3.3(S) Q6.5(D) Q6.6(D) Q6.7(D) Q6.8(D) U6.18(VS1)
SH_B: C35.2 Q2.1(S) Q2.2(S) Q2.3(S) Q5.5(D) Q5.6(D) Q5.7(D) Q5.8(D) U6.15(VS2)
SH_C: C36.2 Q1.1(S) Q1.2(S) Q1.3(S) Q4.5(D) Q4.6(D) Q4.7(D) Q4.8(D) U6.12(VS3)
SPI1_CS: CN1.2 U1.16(PC4)
SPI1_MISO: CN1.4 U1.14(PA6)
SPI1_MOSI: CN1.5 U1.15(PA7)
SPI1_SCK: CN1.3 U1.13(PA5)
SPI3_CS: U1.25(PB12) U7.1(CSN)
SPI3_MISO: U1.42(PB4) U7.6(B/V)
SPI3_MOSI: U1.43(PB5) U7.5(A/U)
SPI3_SCK: U1.41(PB3) U7.7(Z/W)
SWCLK: U1.37(PA14) U8.4
SWDIO: U1.36(PA13) U8.3
USART1_RX: CN3.2 U1.45(PB7)
USART1_TX: CN3.3 U1.44(PB6)
USB-DM: R11.2 U1.33(PA11)
USB-DP: R13.2 U1.34(PA12)
USB-VBUS: D5.2 USBC1.A4(VBUS) USBC1.A9(VBUS) USBC1.B4(VBUS) USBC1.B9(VBUS)
USB_DM: R11.1 USBC1.A7(DN1) USBC1.B7(DN2)
USB_DP: R13.1 USBC1.A6(DP1) USBC1.B6(DP2)
VB_A: C32.1 D3.1 U6.20(VB1)
VB_B: C35.1 D4.1 U6.17(VB2)
VB_C: C36.1 D6.1 U6.14(VB3)
VGS: C3.2 C4.1 C33.1 D1.1 D3.2 D4.2 D6.2 R1.1 U6.4(VCC)
VREF: R22.1 R37.1 R39.1 U9.1(OUTA) U9.2(-INA)
WS2812: LED1.2(DI) U1.12(PA4)
$1N2033: R10.2 USBC1.B5(CC2)
$1N2034: R12.1 USBC1.A5(CC1)
$1N49622: Q1.4(G) R15.2
$1N54089: Q2.4(G) R16.2
$1N54225: Q3.4(G) R17.2
$1N98309: R14.1 R21.2 U9.7(OUTB)
$1N98311: R20.2 R22.2 U9.5(+INB)
$1N98312: R14.2 R19.2 U9.6(-INB)
$1N98316: R18.1 R23.2 U9.3(+INA)
$1N98323: R28.1 R31.2 U9.8(OUTC)
$1N98325: R38.2 R39.2 U9.10(+INC)
$1N98326: R28.2 R30.2 U9.9(-INC)
$1N98330: R27.1 R36.2 U9.14(OUTD)
$1N98332: R35.2 R37.2 U9.12(+IND)
$1N98333: R27.2 R29.2 U9.13(-IND)
$1N121851: Q6.4(G) R26.2
$1N121855: Q5.4(G) R25.2
$1N121861: Q4.4(G) R24.2
$1N127905: R5.2 U2.4(EN)
$1N127907: R1.2 R6.1 U2.3(FB)
$1N127913: D1.2 L1.2 U2.1(SW)
$1N143010: R4.2 R7.1 U4.3(FB)
$1N143011: C1.2 L2.1 U4.6(SW)
$1N143012: C1.1 U4.1(BS)
$1N143454: R2.1 U4.4(EN)
$1N167505: LED2.2(A) R43.2

Not connected (* = marked no-connect by the designer): LED1 4(DO)*; U1 2(PC13)* 3(PC14-OSC32_IN)* 4(PC15-OSC32_OUT)* 17(PB0)* 18(PB1)* 22(PB10)* 24(PB11)* 29(PC6)* 38(PA15)* 39(PC10)* 40(PC11)*; U2 6(NC)*; U3 4(NC)*; U6 5(NC)* 7(NC)* 8(NC)* 21(NC)*; U7 3(OUT)*; USBC1 A8(SBU1)* B8(SBU2)*

## Notes on the sheet
- DCBUS---5V
- 5V---12V
- 5V---3.3V
- MCU
- VFB = 0.8V
- VOUT = VFB * (R7 + R8) / R8
- 电源滤波
- CAN通讯
- SPI接口
- MCU滤波
- 晶振
- 三相半桥驱动
- 自举电路
- USB接口
- 板载磁编码器
- F
  O
  C
- 下载口
- 复
  位
  按
  键
- 驱动电路
- 电流采样
- 电压采样
- 温度采样
- 指示灯
- 串口
- M2.5螺丝孔
